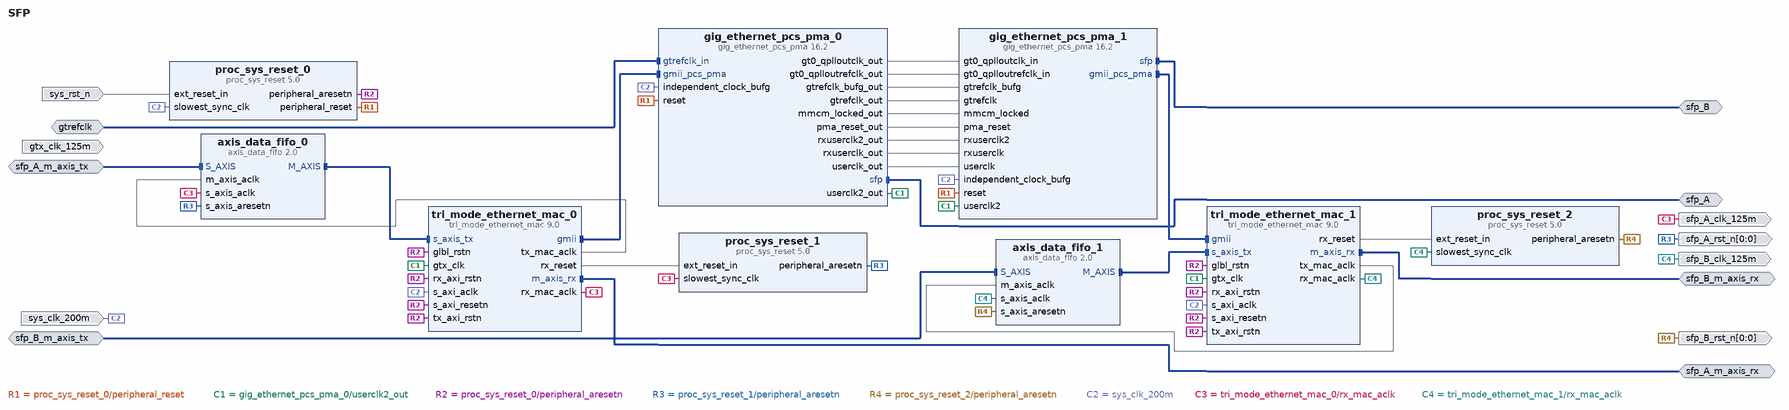
[diagram p0: block diagram of the top level]
# Vivado block design SFP, xc7k325tffg676-2, Vivado 2023.1
create_bd_design SFP

create_bd_intf_port -mode Slave -vlnv xilinx.com:interface:diff_clock_rtl:1.0 gtrefclk
create_bd_intf_port -mode Master -vlnv xilinx.com:interface:sfp_rtl:1.0 sfp_B
create_bd_intf_port -mode Master -vlnv xilinx.com:interface:sfp_rtl:1.0 sfp_A
create_bd_intf_port -mode Master -vlnv xilinx.com:interface:axis_rtl:1.0 sfp_A_m_axis_rx
create_bd_intf_port -mode Slave -vlnv xilinx.com:interface:axis_rtl:1.0 sfp_A_m_axis_tx
set_property -dict [list \
  CONFIG.HAS_TKEEP 0 \
  CONFIG.HAS_TLAST 0 \
  CONFIG.HAS_TREADY 1 \
  CONFIG.HAS_TSTRB 0 \
  CONFIG.LAYERED_METADATA undef \
  CONFIG.TDATA_NUM_BYTES 1 \
  CONFIG.TDEST_WIDTH 0 \
  CONFIG.TID_WIDTH 0 \
  CONFIG.TUSER_WIDTH 0 \
] [get_bd_intf_ports sfp_A_m_axis_tx]
create_bd_intf_port -mode Slave -vlnv xilinx.com:interface:axis_rtl:1.0 sfp_B_m_axis_tx
set_property -dict [list \
  CONFIG.HAS_TKEEP 0 \
  CONFIG.HAS_TLAST 0 \
  CONFIG.HAS_TREADY 1 \
  CONFIG.HAS_TSTRB 0 \
  CONFIG.LAYERED_METADATA undef \
  CONFIG.TDATA_NUM_BYTES 1 \
  CONFIG.TDEST_WIDTH 0 \
  CONFIG.TID_WIDTH 0 \
  CONFIG.TUSER_WIDTH 0 \
] [get_bd_intf_ports sfp_B_m_axis_tx]
create_bd_intf_port -mode Master -vlnv xilinx.com:interface:axis_rtl:1.0 sfp_B_m_axis_rx
create_bd_port -dir I -type clk sys_clk_200m
set_property -dict {CONFIG.ASSOCIATED_RESET sys_rst_n CONFIG.FREQ_HZ 200000000} [get_bd_ports sys_clk_200m]
create_bd_port -dir I -type rst sys_rst_n
create_bd_port -dir I -type clk gtx_clk_125m
set_property -dict {CONFIG.FREQ_HZ 125000000} [get_bd_ports gtx_clk_125m]
create_bd_port -dir O -type clk sfp_A_clk_125m
set_property -dict {CONFIG.ASSOCIATED_BUSIF sfp_A_m_axis_tx:sfp_A_m_axis_rx} [get_bd_ports sfp_A_clk_125m]
create_bd_port -dir O -type clk sfp_B_clk_125m
set_property -dict {CONFIG.ASSOCIATED_BUSIF sfp_B_m_axis_rx:sfp_B_m_axis_tx} [get_bd_ports sfp_B_clk_125m]
create_bd_port -dir O -from 0 -to 0 -type rst sfp_A_rst_n
create_bd_port -dir O -from 0 -to 0 -type rst sfp_B_rst_n

create_bd_cell -type ip -vlnv xilinx.com:ip:gig_ethernet_pcs_pma:16.2 gig_ethernet_pcs_pma_0
set_property -dict [list \
  CONFIG.Auto_Negotiation false \
  CONFIG.Management_Interface false \
  CONFIG.Physical_Interface Transceiver \
  CONFIG.RxGmiiClkSrc TXOUTCLK \
  CONFIG.Standard 1000BASEX \
  CONFIG.SupportLevel Include_Shared_Logic_in_Core \
] [get_bd_cells gig_ethernet_pcs_pma_0]
create_bd_cell -type ip -vlnv xilinx.com:ip:tri_mode_ethernet_mac:9.0 tri_mode_ethernet_mac_0
set_property -dict [list \
  CONFIG.Enable_MDIO false \
  CONFIG.Frame_Filter false \
  CONFIG.Int_Clk_Src user_clk2 \
  CONFIG.MAC_Speed 1000_Mbps \
  CONFIG.Management_Frequency 200 \
  CONFIG.Physical_Interface Internal \
  CONFIG.Statistics_Counters false \
] [get_bd_cells tri_mode_ethernet_mac_0]
create_bd_cell -type ip -vlnv xilinx.com:ip:gig_ethernet_pcs_pma:16.2 gig_ethernet_pcs_pma_1
set_property -dict {CONFIG.Auto_Negotiation false CONFIG.Management_Interface false} [get_bd_cells gig_ethernet_pcs_pma_1]
create_bd_cell -type ip -vlnv xilinx.com:ip:tri_mode_ethernet_mac:9.0 tri_mode_ethernet_mac_1
set_property -dict [list \
  CONFIG.Enable_MDIO false \
  CONFIG.Frame_Filter false \
  CONFIG.Int_Clk_Src user_clk2 \
  CONFIG.MAC_Speed 1000_Mbps \
  CONFIG.Management_Frequency 200 \
  CONFIG.Physical_Interface Internal \
  CONFIG.Statistics_Counters false \
] [get_bd_cells tri_mode_ethernet_mac_1]
create_bd_cell -type ip -vlnv xilinx.com:ip:proc_sys_reset:5.0 proc_sys_reset_0
create_bd_cell -type ip -vlnv xilinx.com:ip:proc_sys_reset:5.0 proc_sys_reset_1
create_bd_cell -type ip -vlnv xilinx.com:ip:axis_data_fifo:2.0 axis_data_fifo_0
set_property -dict {CONFIG.IS_ACLK_ASYNC 1} [get_bd_cells axis_data_fifo_0]
create_bd_cell -type ip -vlnv xilinx.com:ip:axis_data_fifo:2.0 axis_data_fifo_1
set_property -dict {CONFIG.IS_ACLK_ASYNC 1} [get_bd_cells axis_data_fifo_1]
create_bd_cell -type ip -vlnv xilinx.com:ip:proc_sys_reset:5.0 proc_sys_reset_2

# ---- connections ----

connect_bd_intf_net -intf_net S_AXIS_0_1 [get_bd_intf_ports sfp_A_m_axis_tx] [get_bd_intf_pins axis_data_fifo_0/S_AXIS]
connect_bd_intf_net -intf_net S_AXIS_0_2 [get_bd_intf_ports sfp_B_m_axis_tx] [get_bd_intf_pins axis_data_fifo_1/S_AXIS]
connect_bd_intf_net [get_bd_intf_pins axis_data_fifo_0/M_AXIS] [get_bd_intf_pins tri_mode_ethernet_mac_0/s_axis_tx]
connect_bd_intf_net [get_bd_intf_pins axis_data_fifo_1/M_AXIS] [get_bd_intf_pins tri_mode_ethernet_mac_1/s_axis_tx]
connect_bd_intf_net [get_bd_intf_ports sfp_A] [get_bd_intf_pins gig_ethernet_pcs_pma_0/sfp]
connect_bd_intf_net [get_bd_intf_ports sfp_B] [get_bd_intf_pins gig_ethernet_pcs_pma_1/sfp]
connect_bd_intf_net -intf_net gtrefclk_in_0_1 [get_bd_intf_ports gtrefclk] [get_bd_intf_pins gig_ethernet_pcs_pma_0/gtrefclk_in]
connect_bd_intf_net [get_bd_intf_pins tri_mode_ethernet_mac_0/gmii] [get_bd_intf_pins gig_ethernet_pcs_pma_0/gmii_pcs_pma]
connect_bd_intf_net [get_bd_intf_ports sfp_A_m_axis_rx] [get_bd_intf_pins tri_mode_ethernet_mac_0/m_axis_rx]
connect_bd_intf_net [get_bd_intf_pins gig_ethernet_pcs_pma_1/gmii_pcs_pma] [get_bd_intf_pins tri_mode_ethernet_mac_1/gmii]
connect_bd_intf_net [get_bd_intf_ports sfp_B_m_axis_rx] [get_bd_intf_pins tri_mode_ethernet_mac_1/m_axis_rx]
connect_bd_net [get_bd_pins proc_sys_reset_0/peripheral_reset] [get_bd_pins gig_ethernet_pcs_pma_1/reset] [get_bd_pins gig_ethernet_pcs_pma_0/reset]
connect_bd_net [get_bd_pins gig_ethernet_pcs_pma_0/gt0_qplloutclk_out] [get_bd_pins gig_ethernet_pcs_pma_1/gt0_qplloutclk_in]
connect_bd_net [get_bd_pins gig_ethernet_pcs_pma_0/gt0_qplloutrefclk_out] [get_bd_pins gig_ethernet_pcs_pma_1/gt0_qplloutrefclk_in]
connect_bd_net [get_bd_pins gig_ethernet_pcs_pma_0/gtrefclk_bufg_out] [get_bd_pins gig_ethernet_pcs_pma_1/gtrefclk_bufg]
connect_bd_net [get_bd_pins gig_ethernet_pcs_pma_0/gtrefclk_out] [get_bd_pins gig_ethernet_pcs_pma_1/gtrefclk]
connect_bd_net [get_bd_pins gig_ethernet_pcs_pma_0/mmcm_locked_out] [get_bd_pins gig_ethernet_pcs_pma_1/mmcm_locked]
connect_bd_net [get_bd_pins gig_ethernet_pcs_pma_0/pma_reset_out] [get_bd_pins gig_ethernet_pcs_pma_1/pma_reset]
connect_bd_net [get_bd_pins gig_ethernet_pcs_pma_0/rxuserclk2_out] [get_bd_pins gig_ethernet_pcs_pma_1/rxuserclk2]
connect_bd_net [get_bd_pins gig_ethernet_pcs_pma_0/rxuserclk_out] [get_bd_pins gig_ethernet_pcs_pma_1/rxuserclk]
connect_bd_net [get_bd_pins gig_ethernet_pcs_pma_0/userclk2_out] \
  [get_bd_pins gig_ethernet_pcs_pma_1/userclk2] [get_bd_pins tri_mode_ethernet_mac_1/gtx_clk] \
  [get_bd_pins tri_mode_ethernet_mac_0/gtx_clk]
connect_bd_net [get_bd_pins gig_ethernet_pcs_pma_0/userclk_out] [get_bd_pins gig_ethernet_pcs_pma_1/userclk]
connect_bd_net [get_bd_pins proc_sys_reset_0/peripheral_aresetn] \
  [get_bd_pins tri_mode_ethernet_mac_1/tx_axi_rstn] [get_bd_pins tri_mode_ethernet_mac_1/rx_axi_rstn] \
  [get_bd_pins tri_mode_ethernet_mac_1/glbl_rstn] [get_bd_pins tri_mode_ethernet_mac_1/s_axi_resetn] \
  [get_bd_pins tri_mode_ethernet_mac_0/s_axi_resetn] [get_bd_pins tri_mode_ethernet_mac_0/glbl_rstn] \
  [get_bd_pins tri_mode_ethernet_mac_0/rx_axi_rstn] [get_bd_pins tri_mode_ethernet_mac_0/tx_axi_rstn]
connect_bd_net [get_bd_pins proc_sys_reset_1/peripheral_aresetn] [get_bd_pins axis_data_fifo_0/s_axis_aresetn] [get_bd_ports sfp_A_rst_n]
connect_bd_net [get_bd_pins proc_sys_reset_2/peripheral_aresetn] [get_bd_pins axis_data_fifo_1/s_axis_aresetn] [get_bd_ports sfp_B_rst_n]
connect_bd_net [get_bd_ports sys_clk_200m] \
  [get_bd_pins tri_mode_ethernet_mac_0/s_axi_aclk] [get_bd_pins tri_mode_ethernet_mac_1/s_axi_aclk] \
  [get_bd_pins gig_ethernet_pcs_pma_0/independent_clock_bufg] [get_bd_pins gig_ethernet_pcs_pma_1/independent_clock_bufg] \
  [get_bd_pins proc_sys_reset_0/slowest_sync_clk]
connect_bd_net [get_bd_ports sys_rst_n] [get_bd_pins proc_sys_reset_0/ext_reset_in]
connect_bd_net [get_bd_pins tri_mode_ethernet_mac_0/rx_mac_aclk] \
  [get_bd_pins proc_sys_reset_1/slowest_sync_clk] [get_bd_ports sfp_A_clk_125m] [get_bd_pins axis_data_fifo_0/s_axis_aclk]
connect_bd_net [get_bd_pins tri_mode_ethernet_mac_0/rx_reset] [get_bd_pins proc_sys_reset_1/ext_reset_in]
connect_bd_net [get_bd_pins tri_mode_ethernet_mac_0/tx_mac_aclk] [get_bd_pins axis_data_fifo_0/m_axis_aclk]
connect_bd_net [get_bd_pins tri_mode_ethernet_mac_1/rx_mac_aclk] \
  [get_bd_pins proc_sys_reset_2/slowest_sync_clk] [get_bd_pins axis_data_fifo_1/s_axis_aclk] [get_bd_ports sfp_B_clk_125m]
connect_bd_net [get_bd_pins tri_mode_ethernet_mac_1/rx_reset] [get_bd_pins proc_sys_reset_2/ext_reset_in]
connect_bd_net [get_bd_pins tri_mode_ethernet_mac_1/tx_mac_aclk] [get_bd_pins axis_data_fifo_1/m_axis_aclk]

validate_bd_design
save_bd_design
